# EAGLE design fm_notch (EAGLE 9.6.2)
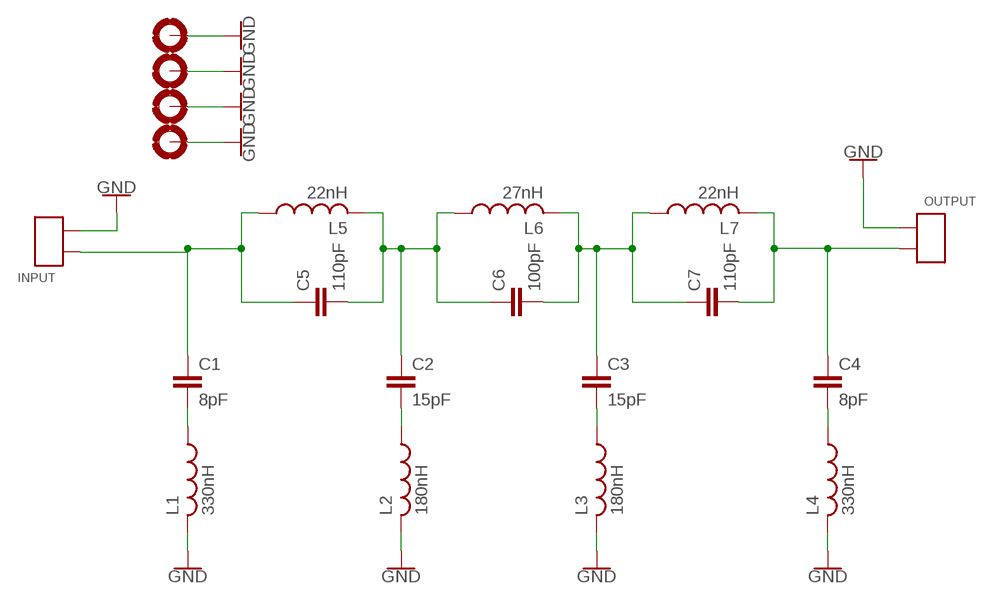
[diagram p0: schematic, sheet 1]

## Parts
C1  8pF  C_0805_SMD  [C0805]
C2  15pF  C_0805_SMD  [C0805]
C3  15pF  C_0805_SMD  [C0805]
C4  8pF  C_0805_SMD  [C0805]
C5  110pF  C_0805_SMD  [C0805]
C6  100pF  C_0805_SMD  [C0805]
C7  110pF  C_0805_SMD  [C0805]
H1  MOUNT-PAD-ROUND3.0  [3,0-PAD]
H2  MOUNT-PAD-ROUND3.0  [3,0-PAD]
H3  MOUNT-PAD-ROUND3.0  [3,0-PAD]
H4  MOUNT-PAD-ROUND3.0  [3,0-PAD]
INPUT  INPUT  2X_SMD_PTH_PIN  [2X_SMD_PTH]
L1  330nH  L0805  [C0805]
L2  180nH  L0805  [C0805]
L3  180nH  L0805  [C0805]
L4  330nH  L0805  [C0805]
L5  22nH  L0805  [C0805]
L6  27nH  L0805  [C0805]
L7  22nH  L0805  [C0805]
OUTPUT  2X_SMD_PTH_PIN  [2X_SMD_PTH]

## Nets
GND: H1.B3,0(MOUNT) H2.B3,0(MOUNT) H3.B3,0(MOUNT) H4.B3,0(MOUNT) INPUT.P$2(PIN1) INPUT.T$2(PIN1) L1.2 L2.2 L3.2 L4.2 OUTPUT.P$1(PIN0) OUTPUT.T$1(PIN0)
N$1: C1.1 C5.1 INPUT.P$1(PIN0) INPUT.T$1(PIN0) L5.1
N$3: C2.2 L2.1
N$4: C3.1 C6.2 C7.1 L6.2 L7.1
N$5: C3.2 L3.1
N$6: C4.1 C7.2 L7.2 OUTPUT.P$2(PIN1) OUTPUT.T$2(PIN1)
N$7: C4.2 L4.1
N$8: C2.1 C5.2 C6.1 L5.2 L6.1
N$9: C1.2 L1.1

## Library data of the parts
C1-C7 = mylib:C_0805_SMD
H1-H4 = holes:MOUNT-PAD-ROUND: MOUNTING PAD, round
INPUT OUTPUT = mylib:2X_SMD_PTH_PIN
L1-L7 = mylib:L0805

## Board
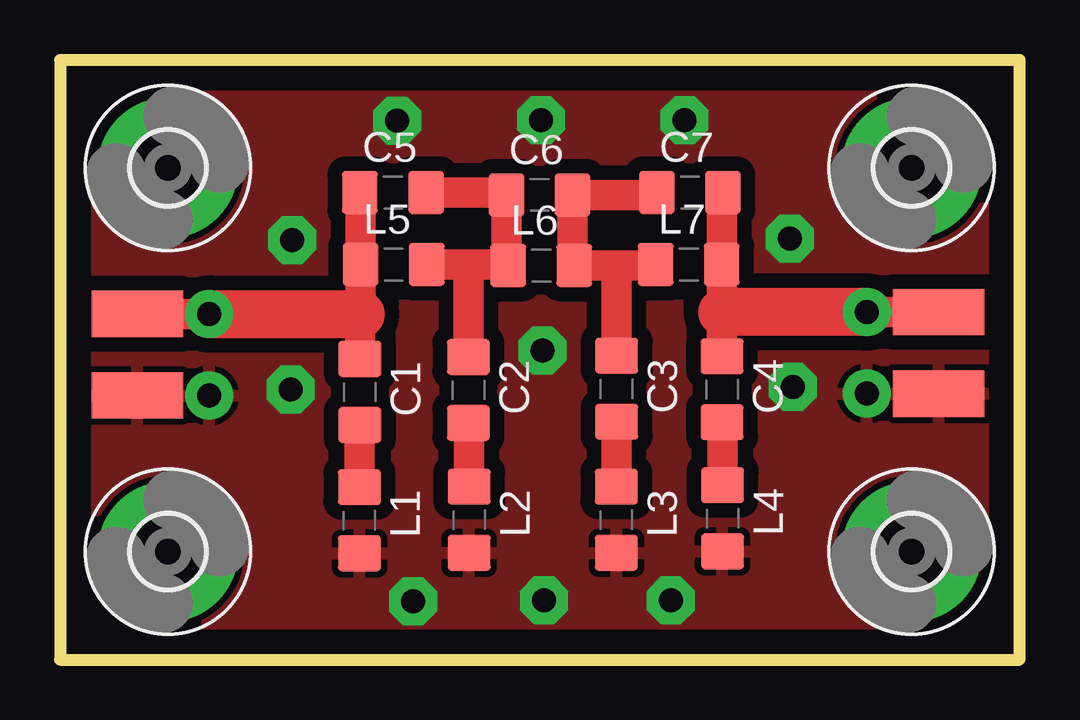
[diagram p1: board, top side]
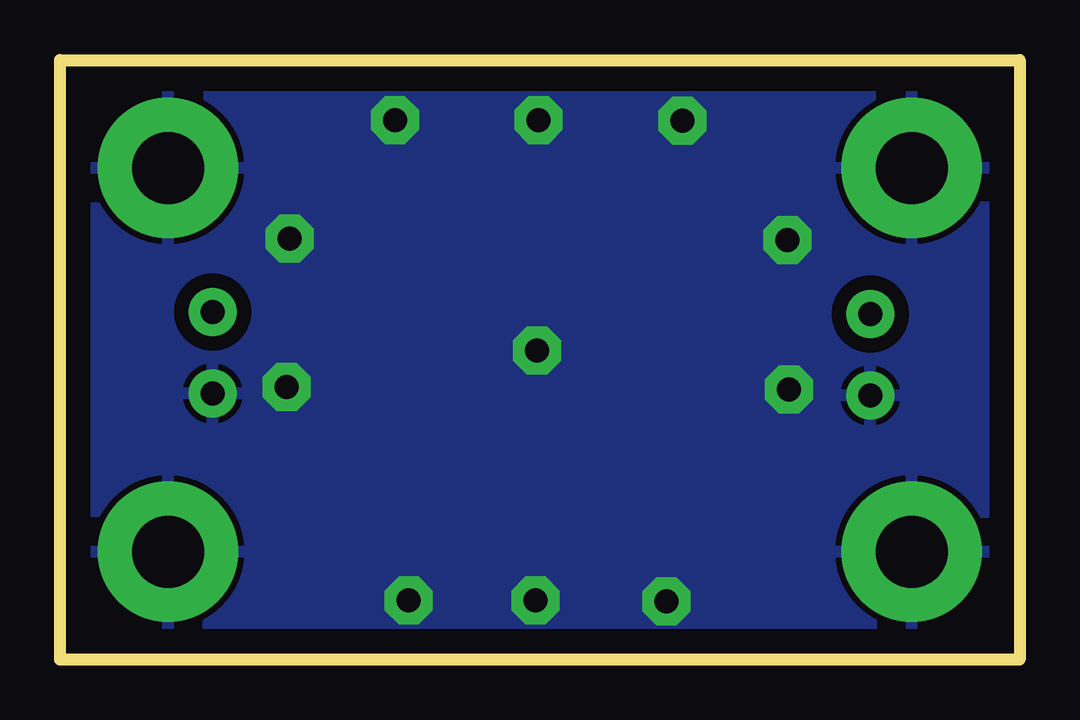
[diagram p2: board, bottom side, seen from below]

Size 40 x 25 mm. Coordinates in mm from the lower left corner, seen from the top.
Outline: 0,0 40,0 40,25 0,25 0,0
Copper layers (1*16): Top 0.035mm / dielectric 1.5mm / Bottom 0.035mm
Design rules "default": minimum track width 6mil, minimum drill 0.35mm, track to track 6mil, track to pad 6mil, pad to pad 6mil, via to via 6mil, smd to smd 6mil, copper to edge 40mil, drill to drill 6mil, minimum pad ring 10mil, minimum via ring 8mil, stop-mask expansion 4mil, vias tented up to drill 0mil, thermal gap 10mil

### Footprints (pad centres in the part's own frame; a part is rotated, then mirrored left to right if it is on the bottom)
C0805 = smd 1.5 x 1.8: 1 -1.377,0; 2 1.377,0
3,0-PAD = drill 3 pad 5.842: B3,0 0,0
2X_SMD_PTH = smd 3.81 x 1.93: P$1 0,1.7; P$2 0,-1.7 | drill 1 pad 2: T$1 3,1.7; T$2 3,-1.7

### Placement (x,y rotation side)
C1  12.5,11.16 270 top
C2  17.03,11.24 270 top
C3  23.2,11.29 270 top
C4  27.6,11.27 270 top
C5  13.88,19.47 0 top
C6  19.99,19.37 0 top
C7  26.26,19.47 0 top
H1  4.5,4.5 180 top
H2  4.5,20.5 0 top
H3  35.5,4.5 0 top
H4  35.5,20.5 0 top
INPUT  3.22,12.71 0 top
L1  12.48,5.81 270 top
L2  17.06,5.83 270 top
L3  23.19,5.83 270 top
L4  27.62,5.89 270 top
L5  13.91,16.47 0 top
L6  20.06,16.43 0 top
L7  26.21,16.47 0 top
OUTPUT  36.63,12.79 180 top

### Tracks (layer width: path | path; a pad name or v marks a point on that pad's centre or on a via)
GND  (via drill 1 pad 2)
  other vias: 14.06,22.47 20.05,22.5 26.04,22.5 25.46,2.46 20.17,2.46 14.72,2.43 9.61,11.26 30.55,11.36 20.12,12.89 9.67,17.5 30.42,17.56
  pour Top (isolate 0.6): -2.5,28.5 -2.5,-3 43.5,-3 43.5,28.5
  pour Bottom (isolate 0.6): -2.5,27.5 -2.5,-3 43.5,-3 43.5,27.5
N$1
  Top 1.27: INPUT.P$1 INPUT.T$1 | L5.1 | L5.1 12.53,19.44 C5.1 | C1.1 12.5,14.36 12.54,14.4 L5.1 | L5.1
  Top 2: 12.54,14.4 INPUT.T$1
N$3
  Top 1.27: C2.2 17.06,9.83 L2.1
N$4
  Top 1.27: C7.1 24.78,19.37 C6.2 21.37,16.5 L6.2 23.54,16.43 | 23.54,16.43 24.79,16.43 L7.1 | C3.1 23.2,16.09 23.54,16.43
N$5
  Top 1.27: L3.1 C3.2
N$6
  Top 1.27: C7.2 27.59,19.42 L7.2 27.6,16.46 27.6,14.48 27.6,14.45 27.6,13.96 C4.1 | OUTPUT.T$2 | OUTPUT.P$2 OUTPUT.T$2
  Top 2: OUTPUT.T$2 27.6,14.48
N$7
  Top 1.27: L4.1 27.62,9.87 C4.2
N$8
  Top 1.27: C5.2 18.51,19.47 C6.1 18.61,16.5 L6.1 18.64,16.47 17.04,16.47 | L5.2 17.04,16.47 | C2.1 17.03,16.46 17.04,16.47
N$9
  Top 1.27: L1.1 12.48,9.76 C1.2